# EAGLE schematic haasoscope_pro_power_board - 5V (EAGLE 9.6.2)
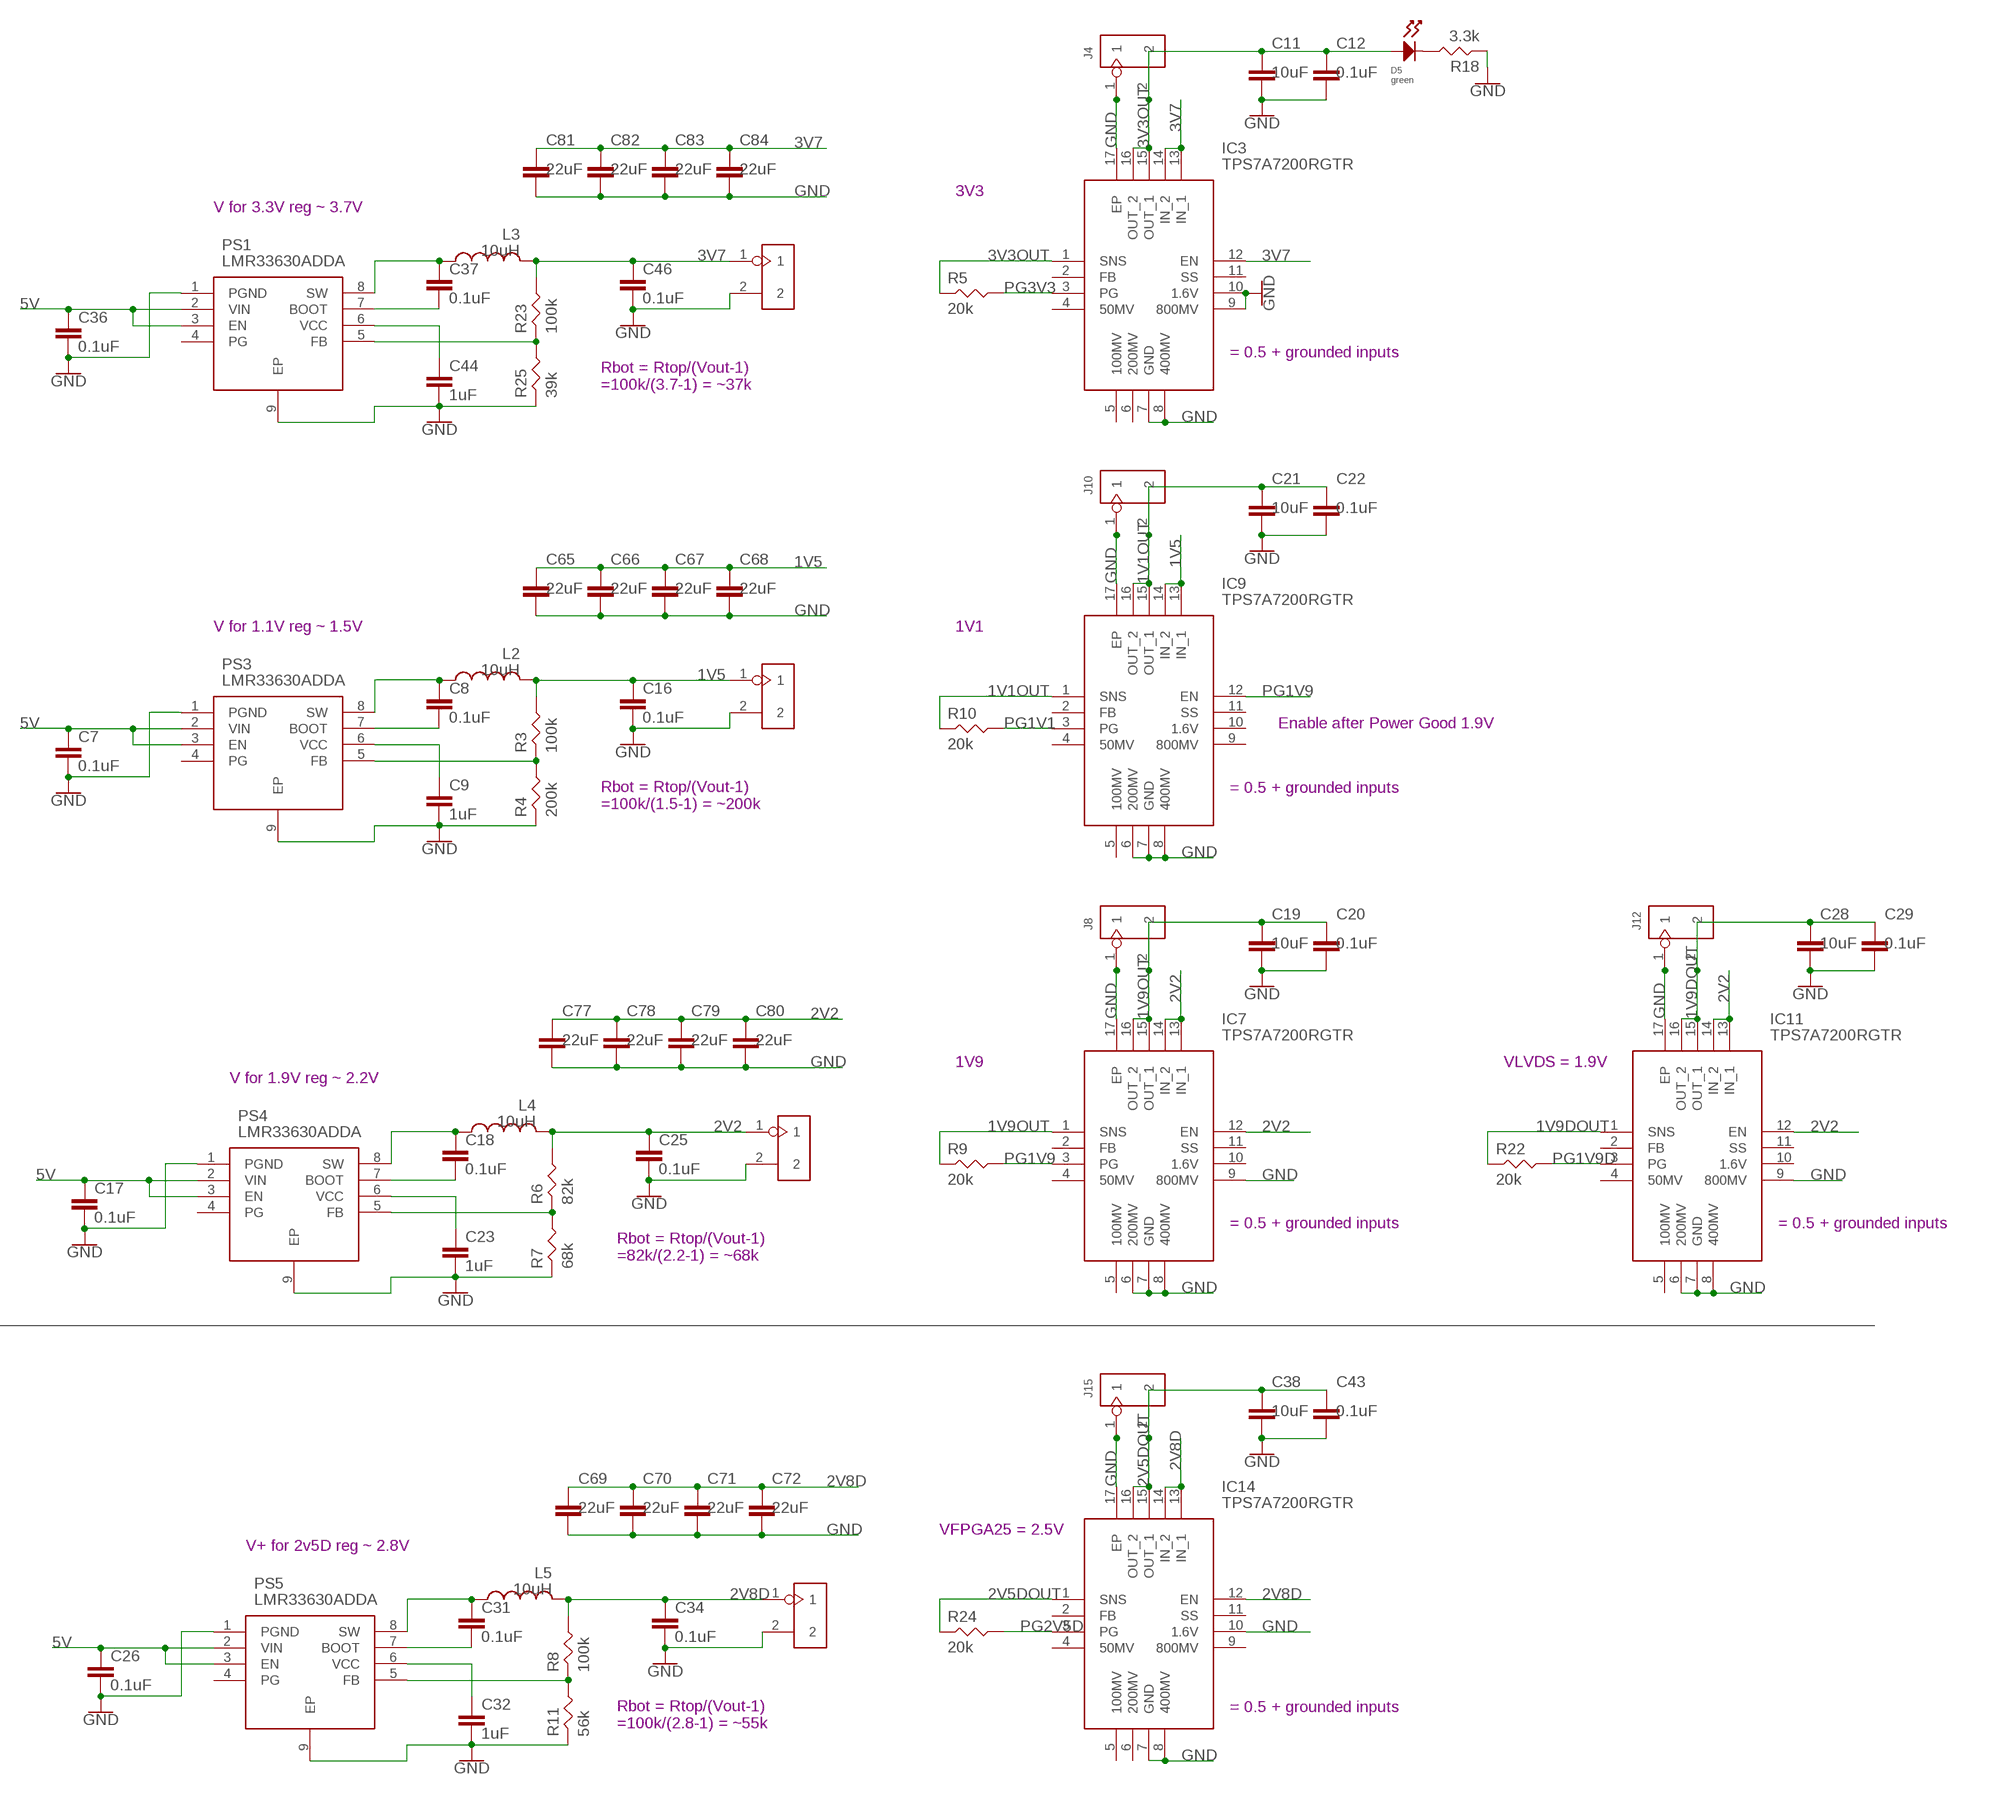
[diagram p0: schematic, sheet 1, part 1 of 2]
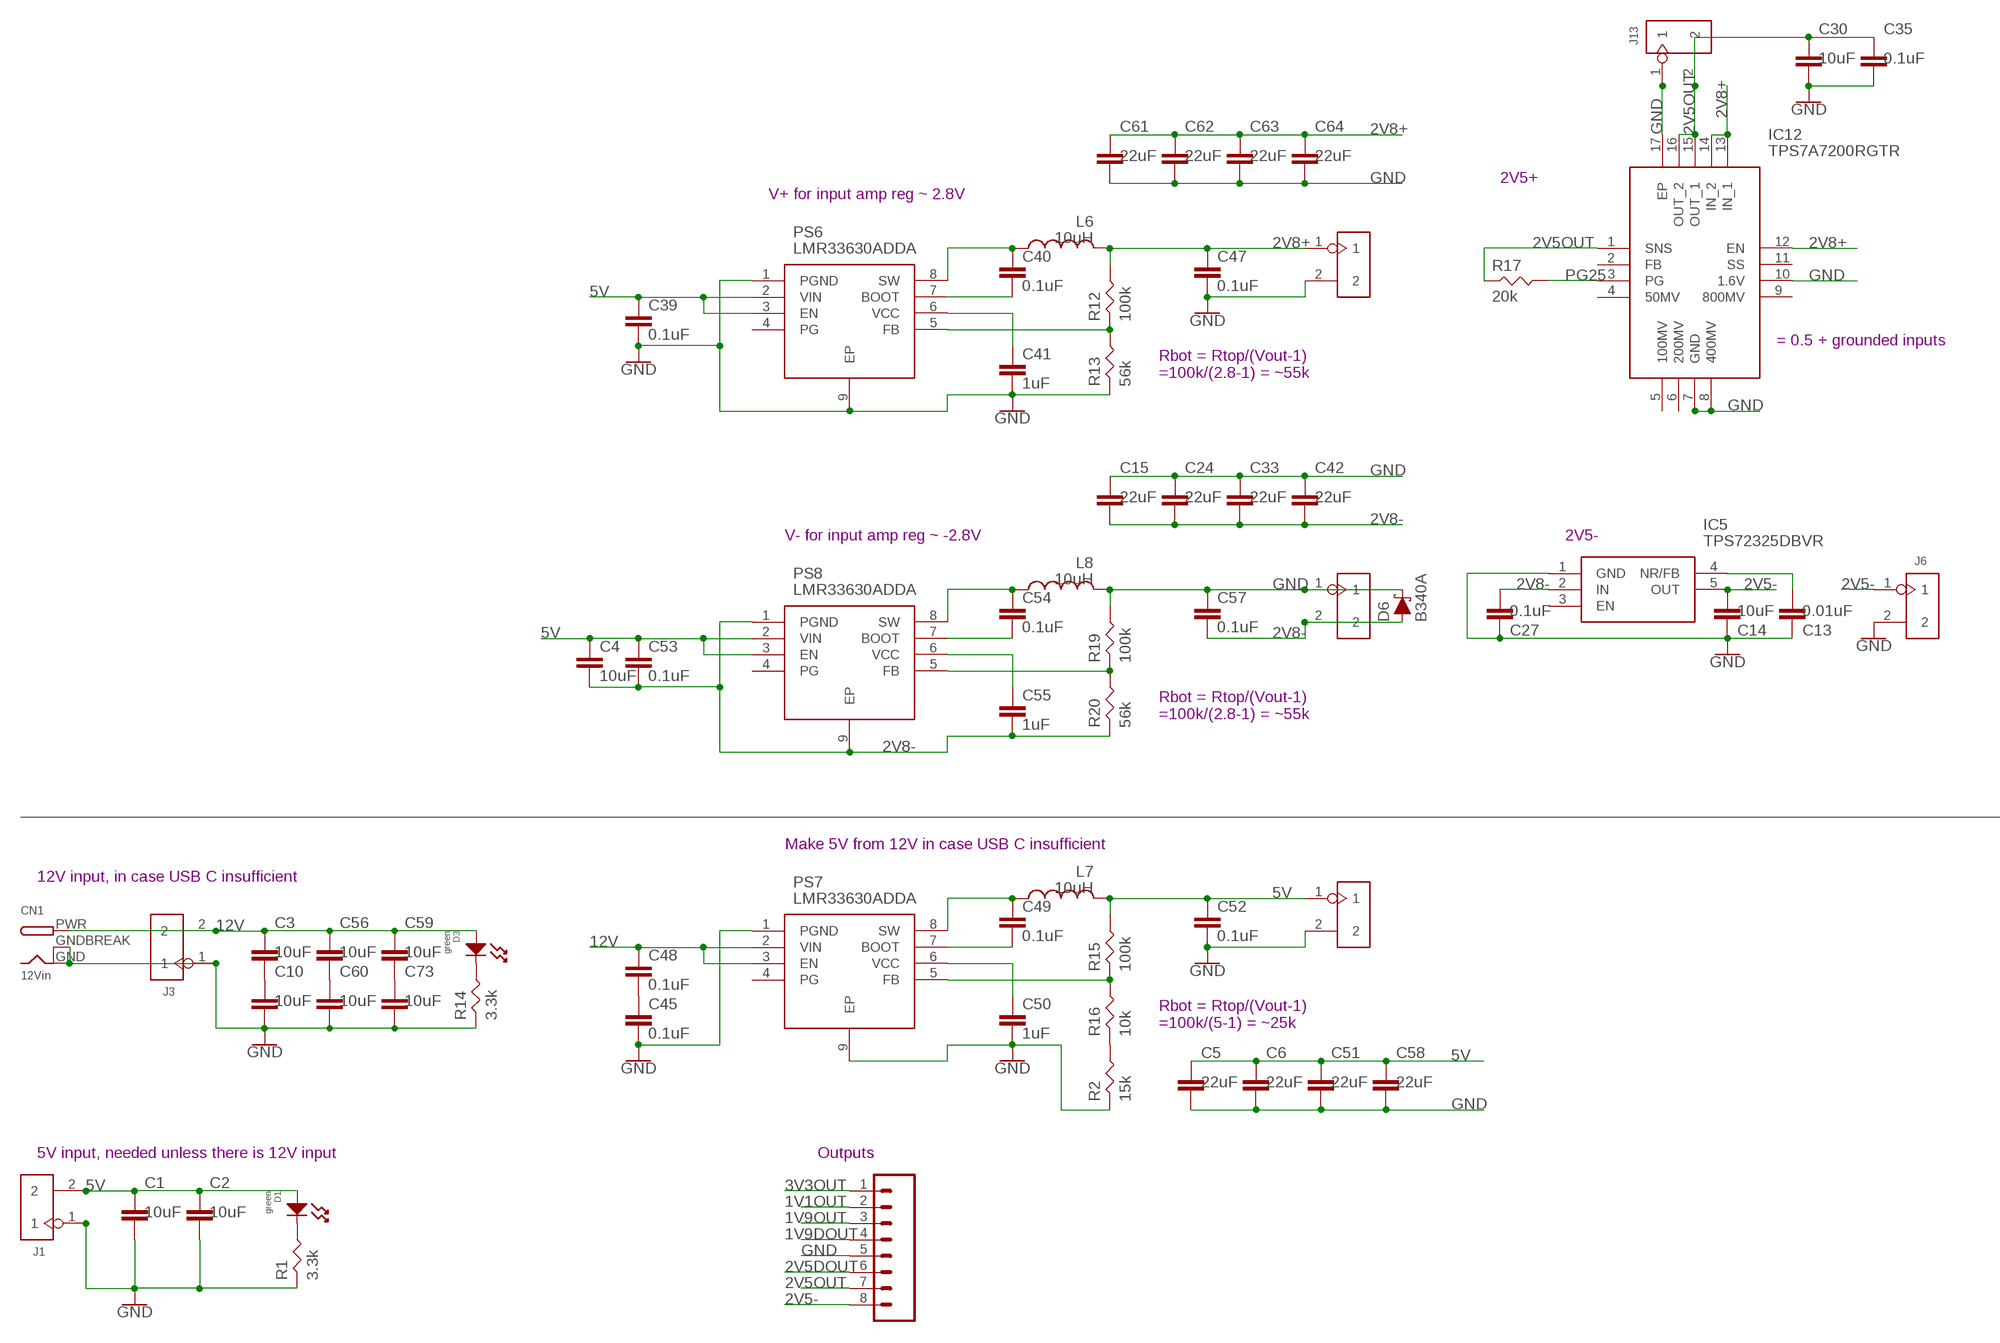
[diagram p1: schematic, sheet 1, part 2 of 2]

## Parts
C1  10uF  CAPACITOR_0805_N  [RESC0805_N]
C2  10uF  CAPACITOR_0805_N  [RESC0805_N]
C3  10uF  CAPACITOR_0805_N  [RESC0805_N]
C4  10uF  CAPACITOR_0805_N  [RESC0805_N]
C5  22uF  CAPACITOR_0805_N  [RESC0805_N]
C6  22uF  CAPACITOR_0805_N  [RESC0805_N]
C7  0.1uF  CAPACITOR_0402_N  [RESC0402_N]
C8  0.1uF  CAPACITOR_0402_N  [RESC0402_N]
C9  1uF  CAPACITOR_0402_N  [RESC0402_N]
C10  10uF  CAPACITOR_0805_N  [RESC0805_N]
C11  10uF  CAPACITOR_0805_N  [RESC0805_N]
C12  0.1uF  CAPACITOR_0402_N  [RESC0402_N]
C13  0.01uF  CAPACITOR_0402_N  [RESC0402_N]
C14  10uF  CAPACITOR_0805_N  [RESC0805_N]
C15  22uF  CAPACITOR_0805_N  [RESC0805_N]
C16  0.1uF  CAPACITOR_0402_N  [RESC0402_N]
C17  0.1uF  CAPACITOR_0402_N  [RESC0402_N]
C18  0.1uF  CAPACITOR_0402_N  [RESC0402_N]
C19  10uF  CAPACITOR_0805_N  [RESC0805_N]
C20  0.1uF  CAPACITOR_0402_N  [RESC0402_N]
C21  10uF  CAPACITOR_0805_N  [RESC0805_N]
C22  0.1uF  CAPACITOR_0402_N  [RESC0402_N]
C23  1uF  CAPACITOR_0402_N  [RESC0402_N]
C24  22uF  CAPACITOR_0805_N  [RESC0805_N]
C25  0.1uF  CAPACITOR_0402_N  [RESC0402_N]
C26  0.1uF  CAPACITOR_0402_N  [RESC0402_N]
C27  0.1uF  CAPACITOR_0402_N  [RESC0402_N]
C28  10uF  CAPACITOR_0805_N  [RESC0805_N]
C29  0.1uF  CAPACITOR_0402_N  [RESC0402_N]
C30  10uF  CAPACITOR_0805_N  [RESC0805_N]
C31  0.1uF  CAPACITOR_0402_N  [RESC0402_N]
C32  1uF  CAPACITOR_0402_N  [RESC0402_N]
C33  22uF  CAPACITOR_0805_N  [RESC0805_N]
C34  0.1uF  CAPACITOR_0402_N  [RESC0402_N]
C35  0.1uF  CAPACITOR_0402_N  [RESC0402_N]
C36  0.1uF  CAPACITOR_0402_N  [RESC0402_N]
C37  0.1uF  CAPACITOR_0402_N  [RESC0402_N]
C38  10uF  CAPACITOR_0805_N  [RESC0805_N]
C39  0.1uF  CAPACITOR_0402_N  [RESC0402_N]
C40  0.1uF  CAPACITOR_0402_N  [RESC0402_N]
C41  1uF  CAPACITOR_0402_N  [RESC0402_N]
C42  22uF  CAPACITOR_0805_N  [RESC0805_N]
C43  0.1uF  CAPACITOR_0402_N  [RESC0402_N]
C44  1uF  CAPACITOR_0402_N  [RESC0402_N]
C45  0.1uF  CAPACITOR_0402_N  [RESC0402_N]
C46  0.1uF  CAPACITOR_0402_N  [RESC0402_N]
C47  0.1uF  CAPACITOR_0402_N  [RESC0402_N]
C48  0.1uF  CAPACITOR_0402_N  [RESC0402_N]
C49  0.1uF  CAPACITOR_0402_N  [RESC0402_N]
C50  1uF  CAPACITOR_0402_N  [RESC0402_N]
C51  22uF  CAPACITOR_0805_N  [RESC0805_N]
C52  0.1uF  CAPACITOR_0402_N  [RESC0402_N]
C53  0.1uF  CAPACITOR_0402_N  [RESC0402_N]
C54  0.1uF  CAPACITOR_0402_N  [RESC0402_N]
C55  1uF  CAPACITOR_0402_N  [RESC0402_N]
C56  10uF  CAPACITOR_0805_N  [RESC0805_N]
C57  0.1uF  CAPACITOR_0402_N  [RESC0402_N]
C58  22uF  CAPACITOR_0805_N  [RESC0805_N]
C59  10uF  CAPACITOR_0805_N  [RESC0805_N]
C60  10uF  CAPACITOR_0805_N  [RESC0805_N]
C61  22uF  CAPACITOR_0805_N  [RESC0805_N]
C62  22uF  CAPACITOR_0805_N  [RESC0805_N]
C63  22uF  CAPACITOR_0805_N  [RESC0805_N]
C64  22uF  CAPACITOR_0805_N  [RESC0805_N]
C65  22uF  CAPACITOR_0805_N  [RESC0805_N]
C66  22uF  CAPACITOR_0805_N  [RESC0805_N]
C67  22uF  CAPACITOR_0805_N  [RESC0805_N]
C68  22uF  CAPACITOR_0805_N  [RESC0805_N]
C69  22uF  CAPACITOR_0805_N  [RESC0805_N]
C70  22uF  CAPACITOR_0805_N  [RESC0805_N]
C71  22uF  CAPACITOR_0805_N  [RESC0805_N]
C72  22uF  CAPACITOR_0805_N  [RESC0805_N]
C73  10uF  CAPACITOR_0805_N  [RESC0805_N]
C77  22uF  CAPACITOR_0805_N  [RESC0805_N]
C78  22uF  CAPACITOR_0805_N  [RESC0805_N]
C79  22uF  CAPACITOR_0805_N  [RESC0805_N]
C80  22uF  CAPACITOR_0805_N  [RESC0805_N]
C81  22uF  CAPACITOR_0805_N  [RESC0805_N]
C82  22uF  CAPACITOR_0805_N  [RESC0805_N]
C83  22uF  CAPACITOR_0805_N  [RESC0805_N]
C84  22uF  CAPACITOR_0805_N  [RESC0805_N]
CN1  12Vin  DCBARRELPTH  [DCJACK_2MM_PTH]
D1  green  LED_SINGLE-0805  [LED0805]
D3  green  LED_SINGLE-0805  [LED0805]
D5  green  LED_SINGLE-0805  [LED0805]
D6  B340A  DIODE-SCHOTTKY-B340A  [SMA-DIODE]
IC3  TPS7A7200RGTR  [QFN50P300X300X100-17N]
IC5  TPS72325DBVR  [SOT95P280X145-5N]
IC7  TPS7A7200RGTR  [QFN50P300X300X100-17N]
IC9  TPS7A7200RGTR  [QFN50P300X300X100-17N]
IC11  TPS7A7200RGTR  [QFN50P300X300X100-17N]
IC12  TPS7A7200RGTR  [QFN50P300X300X100-17N]
IC14  TPS7A7200RGTR  [QFN50P300X300X100-17N]
J1  2p-2.54  DIP-BLACK-MALE-HEADER-VERT(2P-2.54)  [H2-2.54]
J2  2p-2.54  DIP-BLACK-MALE-HEADER-VERT(2P-2.54)  [H2-2.54]
J3  2p-2.54  DIP-BLACK-MALE-HEADER-VERT(2P-2.54)  [H2-2.54]
J4  2p-2.54  DIP-BLACK-MALE-HEADER-VERT(2P-2.54)  [H2-2.54]
J5  2p-2.54  DIP-BLACK-MALE-HEADER-VERT(2P-2.54)  [H2-2.54]
J6  2p-2.54  DIP-BLACK-MALE-HEADER-VERT(2P-2.54)  [H2-2.54]
J7  2p-2.54  DIP-BLACK-MALE-HEADER-VERT(2P-2.54)  [H2-2.54]
J8  2p-2.54  DIP-BLACK-MALE-HEADER-VERT(2P-2.54)  [H2-2.54]
J9  2p-2.54  DIP-BLACK-MALE-HEADER-VERT(2P-2.54)  [H2-2.54]
J10  2p-2.54  DIP-BLACK-MALE-HEADER-VERT(2P-2.54)  [H2-2.54]
J11  2p-2.54  DIP-BLACK-MALE-HEADER-VERT(2P-2.54)  [H2-2.54]
J12  2p-2.54  DIP-BLACK-MALE-HEADER-VERT(2P-2.54)  [H2-2.54]
J13  2p-2.54  DIP-BLACK-MALE-HEADER-VERT(2P-2.54)  [H2-2.54]
J14  2p-2.54  DIP-BLACK-MALE-HEADER-VERT(2P-2.54)  [H2-2.54]
J15  2p-2.54  DIP-BLACK-MALE-HEADER-VERT(2P-2.54)  [H2-2.54]
J16  8pin  CONN_08"  [1X08]
J20  2p-2.54  DIP-BLACK-MALE-HEADER-VERT(2P-2.54)  [H2-2.54]
L2  10uH  INDUCTORPWR  [CDRH125]
L3  10uH  INDUCTORPWR  [CDRH125]
L4  10uH  INDUCTORPWR  [CDRH125]
L5  10uH  INDUCTORPWR  [CDRH125]
L6  10uH  INDUCTORPWR  [CDRH125]
L7  10uH  INDUCTORPWR  [CDRH125]
L8  10uH  INDUCTORPWR  [CDRH125]
PS1  LMR33630ADDA  [SOIC127P600X170-9N]
PS3  LMR33630ADDA  [SOIC127P600X170-9N]
PS4  LMR33630ADDA  [SOIC127P600X170-9N]
PS5  LMR33630ADDA  [SOIC127P600X170-9N]
PS6  LMR33630ADDA  [SOIC127P600X170-9N]
PS7  LMR33630ADDA  [SOIC127P600X170-9N]
PS8  LMR33630ADDA  [SOIC127P600X170-9N]
R1  3.3k  RES-0402  [RES-0402]
R2  15k  RES-0402  [RES-0402]
R3  100k  RES-0402  [RES-0402]
R4  200k  RES-0402  [RES-0402]
R5  20k  RES-0402  [RES-0402]
R6  82k  RES-0402  [RES-0402]
R7  68k  RES-0402  [RES-0402]
R8  100k  RES-0402  [RES-0402]
R9  20k  RES-0402  [RES-0402]
R10  20k  RES-0402  [RES-0402]
R11  56k  RES-0402  [RES-0402]
R12  100k  RES-0402  [RES-0402]
R13  56k  RES-0402  [RES-0402]
R14  3.3k  RES-0402  [RES-0402]
R15  100k  RES-0402  [RES-0402]
R16  10k  RES-0402  [RES-0402]
R17  20k  RES-0402  [RES-0402]
R18  3.3k  RES-0402  [RES-0402]
R19  100k  RES-0402  [RES-0402]
R20  56k  RES-0402  [RES-0402]
R22  20k  RES-0402  [RES-0402]
R23  100k  RES-0402  [RES-0402]
R24  20k  RES-0402  [RES-0402]
R25  39k  RES-0402  [RES-0402]

## Nets
1V1OUT: C21.1 C22.1 IC9.1(SNS) IC9.15(OUT_1) IC9.16(OUT_2) J10.2 J16.2 R10.P$1
1V5: C16.1 C65.1 C66.1 C67.1 C68.1 IC9.13(IN_1) IC9.14(IN_2) J2.1 L2.2 R3.P$2
1V9DOUT: C28.1 C29.1 IC11.1(SNS) IC11.15(OUT_1) IC11.16(OUT_2) J12.2 J16.4 R22.P$1
1V9OUT: C19.1 C20.1 IC7.1(SNS) IC7.15(OUT_1) IC7.16(OUT_2) J8.2 J16.3 R9.P$1
2V2: C25.1 C77.1 C78.1 C79.1 C80.1 IC7.12(EN) IC7.13(IN_1) IC7.14(IN_2) IC11.12(EN) IC11.13(IN_1) IC11.14(IN_2) J5.1 L4.2 R6.P$2
2V5-: C14.1 IC5.5(OUT) J6.1 J16.8
2V5DOUT: C38.1 C43.1 IC14.1(SNS) IC14.15(OUT_1) IC14.16(OUT_2) J15.2 J16.6 R24.P$1
2V5OUT: C30.1 C35.1 IC12.1(SNS) IC12.15(OUT_1) IC12.16(OUT_2) J13.2 J16.7 R17.P$1
2V8+: C47.1 C61.1 C62.1 C63.1 C64.1 IC12.12(EN) IC12.13(IN_1) IC12.14(IN_2) J9.1 L6.2 R12.P$2
2V8-: C4.2 C15.2 C24.2 C27.1 C33.2 C42.2 C53.2 C55.2 C57.2 D6.A IC5.2(IN) J20.2 PS8.1(PGND) PS8.9(EP) R20.P$1
2V8D: C34.1 C69.1 C70.1 C71.1 C72.1 IC14.12(EN) IC14.13(IN_1) IC14.14(IN_2) J7.1 L5.2 R8.P$2
3V3OUT: C11.1 C12.1 D5.ANODE IC3.1(SNS) IC3.15(OUT_1) IC3.16(OUT_2) J4.2 J16.1 R5.P$1
3V7: C46.1 C81.1 C82.1 C83.1 C84.1 IC3.12(EN) IC3.13(IN_1) IC3.14(IN_2) J14.1 L3.2 R23.P$2
5V: C1.1 C2.1 C4.1 C5.1 C6.1 C7.1 C17.1 C26.1 C36.1 C39.1 C51.1 C52.1 C53.1 C58.1 D1.ANODE J1.2 J11.1 L7.2 PS1.2(VIN) PS1.3(EN) PS3.2(VIN) PS3.3(EN) PS4.2(VIN) PS4.3(EN) PS5.2(VIN) PS5.3(EN) PS6.2(VIN) PS6.3(EN) PS8.2(VIN) PS8.3(EN) R15.P$2
12V: C3.1 C48.1 C56.1 C59.1 CN1.PWR D3.ANODE J3.2 PS7.2(VIN) PS7.3(EN)
GND: C1.2 C2.2 C5.2 C6.2 C7.2 C9.2 C10.2 C11.2 C12.2 C13.2 C14.2 C15.1 C16.2 C17.2 C19.2 C20.2 C21.2 C22.2 C23.2 C24.1 C25.2 C26.2 C27.2 C28.2 C29.2 C30.2 C32.2 C33.1 C34.2 C35.2 C36.2 C38.2 C39.2 C41.2 C42.1 C43.2 C44.2 C45.2 C46.2 C47.2 C50.2 C51.2 C52.2 C57.1 C58.2 C60.2 C61.2 C62.2 C63.2 C64.2 C65.2 C66.2 C67.2 C68.2 C69.2 C70.2 C71.2 C72.2 C73.2 C77.2 C78.2 C79.2 C80.2 C81.2 C82.2 C83.2 C84.2 CN1.GND CN1.GNDBREAK D6.C IC3.7(GND) IC3.8(400MV) IC3.9(800MV) IC3.10(1.6V) IC3.17(EP) IC5.1(GND) IC7.6(200MV) IC7.7(GND) IC7.8(400MV) IC7.9(800MV) IC7.17(EP) IC9.6(200MV) IC9.7(GND) IC9.8(400MV) IC9.17(EP) IC11.6(200MV) IC11.7(GND) IC11.8(400MV) IC11.9(800MV) IC11.17(EP) IC12.7(GND) IC12.8(400MV) IC12.10(1.6V) IC12.17(EP) IC14.7(GND) IC14.8(400MV) IC14.10(1.6V) IC14.17(EP) J1.1 J2.2 J3.1 J4.1 J5.2 J6.2 J7.2 J8.1 J9.2 J10.1 J11.2 J12.1 J13.1 J14.2 J15.1 J16.5 J20.1 L8.2 PS1.1(PGND) PS1.9(EP) PS3.1(PGND) PS3.9(EP) PS4.1(PGND) PS4.9(EP) PS5.1(PGND) PS5.9(EP) PS6.1(PGND) PS6.9(EP) PS7.1(PGND) PS7.9(EP) R1.P$1 R2.P$1 R4.P$1 R7.P$1 R11.P$1 R13.P$1 R14.P$1 R18.P$1 R19.P$2 R25.P$1
N$1: C44.1 PS1.6(VCC)
N$2: C45.1 C48.2
N$3: C3.2 C10.1
N$4: C13.1 IC5.4(NR/FB)
N$5: D3.CATHODE R14.P$2
N$6: D5.CATHODE R18.P$2
N$7: D1.CATHODE R1.P$2
N$11: C37.1 L3.1 PS1.8(SW)
N$12: C37.2 PS1.7(BOOT)
N$13: PS1.5(FB) R23.P$1 R25.P$2
N$14: R2.P$2 R16.P$1
N$15: C56.2 C60.1
N$16: C8.1 L2.1 PS3.8(SW)
N$17: C8.2 PS3.7(BOOT)
N$18: PS3.5(FB) R3.P$1 R4.P$2
N$19: C9.1 PS3.6(VCC)
N$20: C18.1 L4.1 PS4.8(SW)
N$21: C18.2 PS4.7(BOOT)
N$22: PS4.5(FB) R6.P$1 R7.P$2
N$23: C23.1 PS4.6(VCC)
N$24: C31.1 L5.1 PS5.8(SW)
N$25: C31.2 PS5.7(BOOT)
N$26: PS5.5(FB) R8.P$1 R11.P$2
N$27: C32.1 PS5.6(VCC)
N$28: C40.1 L6.1 PS6.8(SW)
N$29: C40.2 PS6.7(BOOT)
N$30: PS6.5(FB) R12.P$1 R13.P$2
N$31: C41.1 PS6.6(VCC)
N$32: C49.1 L7.1 PS7.8(SW)
N$33: C49.2 PS7.7(BOOT)
N$34: PS7.5(FB) R15.P$1 R16.P$2
N$35: C50.1 PS7.6(VCC)
N$36: C54.1 L8.1 PS8.8(SW)
N$37: C54.2 PS8.7(BOOT)
N$38: PS8.5(FB) R19.P$1 R20.P$2
N$39: C55.1 PS8.6(VCC)
N$40: C59.2 C73.1
PG1V1: IC9.3(PG) R10.P$2
PG1V9: IC7.3(PG) IC9.12(EN) R9.P$2
PG1V9D: IC11.3(PG) R22.P$2
PG2V5D: IC14.3(PG) R24.P$2
PG3V3: IC3.3(PG) R5.P$2
PG25: IC12.3(PG) R17.P$2
Unconnected: IC3.2(FB) IC3.4(50MV) IC3.5(100MV) IC3.6(200MV) IC3.11(SS) IC5.3(EN) IC7.2(FB) IC7.4(50MV) IC7.5(100MV) IC7.10(1.6V) IC7.11(SS) IC9.2(FB) IC9.4(50MV) IC9.5(100MV) IC9.9(800MV) IC9.10(1.6V) IC9.11(SS) IC11.2(FB) IC11.4(50MV) IC11.5(100MV) IC11.10(1.6V) IC11.11(SS) IC12.2(FB) IC12.4(50MV) IC12.5(100MV) IC12.6(200MV) IC12.9(800MV) IC12.11(SS) IC14.2(FB) IC14.4(50MV) IC14.5(100MV) IC14.6(200MV) IC14.9(800MV) IC14.11(SS) PS1.4(PG) PS3.4(PG) PS4.4(PG) PS5.4(PG) PS6.4(PG) PS7.4(PG) PS8.4(PG)

## Notes on the sheet
- 3V3
- V for 3.3V reg ~ 3.7V
- = 0.5 + grounded inputs
- Rbot = Rtop/(Vout-1)
  =100k/(3.7-1) = ~37k
- V for 1.1V reg ~ 1.5V | 1V1
- Enable after Power Good 1.9V
- = 0.5 + grounded inputs
- Rbot = Rtop/(Vout-1)
  =100k/(1.5-1) = ~200k
- 1V9 | VLVDS = 1.9V
- V for 1.9V reg ~ 2.2V
- = 0.5 + grounded inputs | = 0.5 + grounded inputs
- Rbot = Rtop/(Vout-1)
  =82k/(2.2-1) = ~68k
- VFPGA25 = 2.5V
- V+ for 2v5D reg ~ 2.8V
- = 0.5 + grounded inputs
- Rbot = Rtop/(Vout-1)
  =100k/(2.8-1) = ~55k
- 2V5+
- V+ for input amp reg ~ 2.8V
- = 0.5 + grounded inputs
- Rbot = Rtop/(Vout-1)
  =100k/(2.8-1) = ~55k
- V- for input amp reg ~ -2.8V | 2V5-
- Rbot = Rtop/(Vout-1)
  =100k/(2.8-1) = ~55k
- Make 5V from 12V in case USB C insufficient
- 12V input, in case USB C insufficient
- Rbot = Rtop/(Vout-1)
  =100k/(5-1) = ~25k
- 5V input, needed unless there is 12V input | Outputs

## Library data of the parts
C1-C44 C46 C47 C49-C73 C77-C84 = Nordic_nRF:CAPACITOR: Generic chip capacitor
C45 C48 = Nordic_nRF:CAPACITOR: Generic chip capacitor; LCSC: C307331
CN1 = adafruit:DCBARREL: 2.0mm DC Barrel Jack DCJACK_2MM_PTH - Through Hole Jack (4UConnector: 05537)
D1 D3 D5 = MF_LEDs:LED_SINGLE: Library: MF_LEDs Description: Device for Single LED Packages. Manufacture part number (MFG#) can be added via Attributes.; HOUSEPART: NO; POPULATE: 1
D6 = SparkFun-DiscreteSemi:DIODE-SCHOTTKY: Schottky diode A Schottky diode is a semiconductor diode which has a low forward voltage drop and a very fast switching action.; LCSC: C64982; PROD_ID: DIO-09886; VALUE: 3A/40V/500mV
IC3 IC7 IC9 IC11 IC12 IC14 = TPS7A7200RGTR:TPS7A7200RGTR: 2A, Single Output, Very Low Input, Configurable Fixed (0.9 to 5.0V) Low-Dropout Linear Regulator Source: Datasheet <http://www.ti.com/lit/gpn/tps7a7200>; DESCRIPTION: 2A, Single Output, Very Low Input, Configurable Fixed (0.9 to 5.0V) Low-Dropout Linear Regulator; HEIGHT: 1mm; MANUFACTURER_NAME: Texas Instruments; MANUFACTURER_PART_NUMBER: TPS7A7200RGTR; MOUSER_PART_NUMBER: 595-TPS7A7200RGTR; MOUSER_PRICE-STOCK: https://www.mouser.co.uk/ProductDetail/Texas-Instruments/TPS7A7200RGTR?qs=N%2FGwOzoYEADhZqusv3bivA%3D%3D
IC5 = TPS72325DBVR:TPS72325DBVR: TEXAS INSTRUMENTS - TPS72325DBVR - LDO, FIXED, -2.5V, 0.2A, SOT-23-5 Source: Datasheet <https://datasheet.datasheetarchive.com/originals/distributors/Datasheets-SFU2/DSASFU100034060.pdf>; DESCRIPTION: TEXAS INSTRUMENTS - TPS72325DBVR - LDO, FIXED, -2.5V, 0.2A, SOT-23-5; HEIGHT: 1.45mm; MANUFACTURER_NAME: Texas Instruments; MANUFACTURER_PART_NUMBER: TPS72325DBVR; MOUSER_PART_NUMBER: 595-TPS72325DBVR; MOUSER_PRICE-STOCK: https://www.mouser.co.uk/ProductDetail/Texas-Instruments/TPS72325DBVR?qs=6zVL%252ByCp0mrCtYCk6%2F08lw%3D%3D
J1-J15 J20 = Seeed-Connector:DIP-BLACK-MALE-HEADER-VERT(2P-2.54): 320020016; MPN: P125-1102A0BS116A1
J16 = SparkFun-Connectors:CONN_08: Multi connection point. Often used as Generic Header-pin footprint for 0.1 inch spaced/style header connections On any of the 0.1 inch spaced packages, you can populate with these: Break Away Headers - Straight <https://www.sparkfun.com/products/116> (PRT-00116) Break Away Male Headers - Right Angle <https://www.sparkfun.com/products/553> (PRT-00553) Female Headers <https://www.sparkfun.com/products/115> (PRT-00115) Break Away Headers - Machine Pin <https://www.sparkfun.com/products/117> (PRT-00117) Break Away Female Headers - Swiss Machine Pin <https://www.sparkfun.com/products/743> (PRT-00743) Arduino Stackable Header - 8 Pin <https://www.sparkfun.com/products/9279> (PRT-09279) For SCREWTERMINALS and SPRING TERMINALS visit here: Screw Terimnals on SparkFun.com <https://www.sparkfun.com/search/results?term=Screw+Terminals> (5mm/3.5mm/2.54mm spacing) This device is also useful as a general connection point to wire up your design to another part of your project. Our various solder wires solder well into these plated through hole pads. Hook-Up Wire - Assortment (Stranded, 22 AWG) <https://www.sparkfun.com/products/11375> (PRT-11375) Hook-Up Wire - Assortment (Solid Core, 22 AWG) <https://www.sparkfun.com/products/11367> (PRT-11367) View the entire wire category on our website here <https://www.sparkfun.com/categories/141> Special notes: Molex polarized connector foot print use with SKU : PRT-08231 with associated crimp pins and housings. 1MM SMD Version SKU: PRT-10208 NOTES ON THE VARIANTS LOCK and LOCK_LONGPADS... This footprint was designed to help hold the alignment of a through-hole component (i.e. 6-pin header) while soldering it into place. You may notice that each hole has been shifted either up or down by 0.005 of an inch from it's more standard position (which is a perfectly straight line). This slight alteration caused the pins (the squares in the middle) to touch the edges of the holes. Because they are alternating, it causes a "brace" to hold the component in place. 0.005 has proven to be the perfect amount of "off-center" position when using our standard breakaway headers. Although looks a little odd when you look at the bare footprint, once you have a header in there, the alteration is very hard to notice. Also,if you push a header all the way into place, it is covered up entirely on the bottom side.; PROD_ID: CONN-08438
L2-L8 = SparkFun-Passives:INDUCTOR: Inductors Basic Inductor/Choke - 0603 and 1206. Footprints are not proven and vary greatly between part numbers. INDUCTOR POWER 3.3UH 4.0A SMD 0.197" L x 0.197" W x 0.177" H (5.00mm x 5.00mm x 4.50mm); LCSC: C339970
PS1 PS3-PS8 = LMR33630ADDA:LMR33630ADDA: SIMPLE SWITCHER 3.8V to 36V, 3A Synchronous Buck Converter With Ultra-Low EMI Source: Datasheet <http://www.ti.com/lit/ds/symlink/lmr33630.pdf>; DESCRIPTION: SIMPLE SWITCHER 3.8V to 36V, 3A Synchronous Buck Converter With Ultra-Low EMI; HEIGHT: 1.7mm; MANUFACTURER_NAME: Texas Instruments; MANUFACTURER_PART_NUMBER: LMR33630ADDA; MOUSER_PART_NUMBER: 595-LMR33630ADDA; MOUSER_PRICE-STOCK: https://www.mouser.co.uk/ProductDetail/Texas-Instruments/LMR33630ADDA?qs=r5DSvlrkXmL3yj62Sna%2FpQ%3D%3D
R1-R20 R22-R25 = FlashPCB_Resistors:RES-0402: https://www.digikey.com/en/products/filter/chip-resistor-surface-mount/52?s=N4IgjCBcpgbFoDGUBmBDANgZwKYBoQB7KAbRAGYBOAJgBZ4BdAgBwBcoQBlVgJwEsAdgHMQAX1EFqpEDxxY%2BWVoR4gGooA

## Net classes
0 default: width 0.305 mm
1 power: width 0.406 mm
2 gnd: width 0.305 mm